# EAGLE design flexdrive_atlas_stack_draft_01 (EAGLE 6.2)
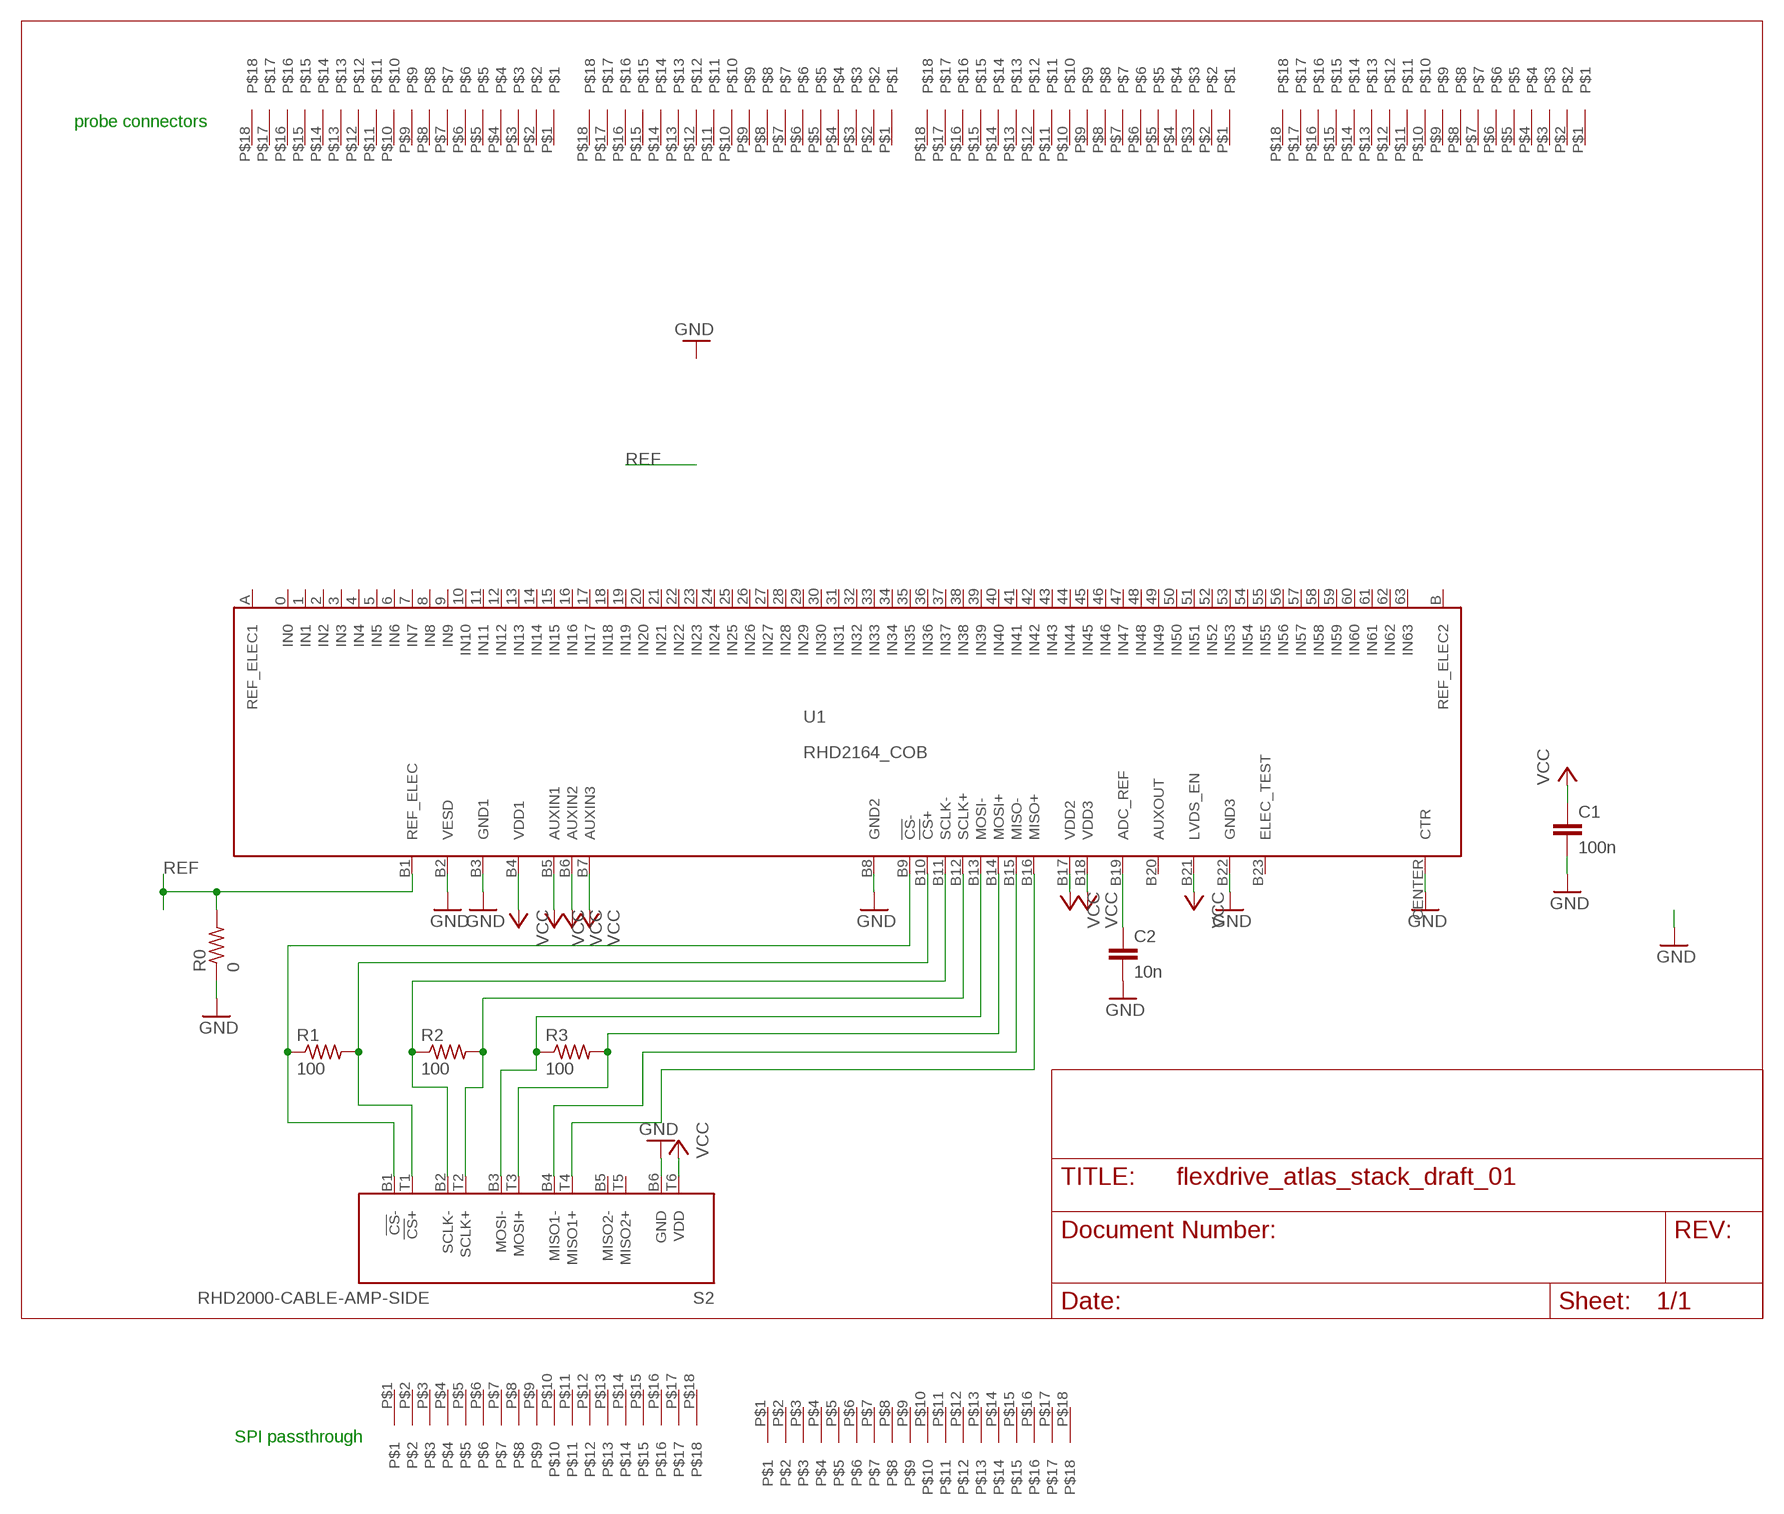
[diagram p0: schematic, sheet 1]

## Parts
C1  100n  C_0402  [0402]
C2  10n  C_0201  [0201]
R0  0  R_0402  [0402]
R1  100  R_0201  [0201]
R2  100  R_0201  [0201]
R3  100  R_0201  [0201]
S2  RHD2000-CABLE-AMP-SIDE  [OMNETICS_PZN-12-AA]
U1  RHD2164_COB  [RHD2164_COB]
U$1  18PIN_035MM_SLIMSTACK  [18PIN_025MM_SLIMSTACK]
U$2  18PIN_035MM_SLIMSTACK  [18PIN_025MM_SLIMSTACK]
U$3  18PIN_035MM_SLIMSTACK  [18PIN_025MM_SLIMSTACK]
U$4  18PIN_035MM_SLIMSTACK  [18PIN_025MM_SLIMSTACK]
U$5  18PIN_035MM_SLIMSTACK  [18PIN_025MM_SLIMSTACK]
U$6  18PIN_035MM_SLIMSTACK  [18PIN_025MM_SLIMSTACK]

## Nets
GND [thick]: C1.2 C2.2 R0.1 S2.B6(GND) U1.B2(VESD) U1.B3(GND1) U1.B8(GND2) U1.B22(GND3) U1.CENTER(CTR)
N$1: S2.T4(MISO1+) U1.B16(MISO+)
N$11: R1.1 S2.B1(!CS!-) U1.B9(!CS!-)
N$35: R1.2 S2.T1(!CS!+) U1.B10(!CS!+)
N$36: R2.1 S2.B2(SCLK-) U1.B11(SCLK-)
N$37: R2.2 S2.T2(SCLK+) U1.B12(SCLK+)
N$38: R3.1 S2.B3(MOSI-) U1.B13(MOSI-)
N$39: R3.2 S2.T3(MOSI+) U1.B14(MOSI+)
N$40: S2.B4(MISO1-) U1.B15(MISO-)
N$42 [thick]: C2.1 U1.B19(ADC_REF)
REF [thick]: R0.2 U1.B1(REF_ELEC)
VCC [thick]: C1.1 S2.T6(VDD) U1.B4(VDD1) U1.B5(AUXIN1) U1.B6(AUXIN2) U1.B7(AUXIN3) U1.B17(VDD2) U1.B18(VDD3) U1.B21(LVDS_EN)
Unconnected: S2.B5(MISO2-) S2.T5(MISO2+) U1.0(IN0) U1.1(IN1) U1.2(IN2) U1.3(IN3) U1.4(IN4) U1.5(IN5) U1.6(IN6) U1.7(IN7) U1.8(IN8) U1.9(IN9) U1.10(IN10) U1.11(IN11) U1.12(IN12) U1.13(IN13) U1.14(IN14) U1.15(IN15) U1.16(IN16) U1.17(IN17) U1.18(IN18) U1.19(IN19) U1.20(IN20) U1.21(IN21) U1.22(IN22) U1.23(IN23) U1.24(IN24) U1.25(IN25) U1.26(IN26) U1.27(IN27) U1.28(IN28) U1.29(IN29) U1.30(IN30) U1.31(IN31) U1.32(IN32) U1.33(IN33) U1.34(IN34) U1.35(IN35) U1.36(IN36) U1.37(IN37) U1.38(IN38) U1.39(IN39) U1.40(IN40) U1.41(IN41) U1.42(IN42) U1.43(IN43) U1.44(IN44) U1.45(IN45) U1.46(IN46) U1.47(IN47) U1.48(IN48) U1.49(IN49) U1.50(IN50) U1.51(IN51) U1.52(IN52) U1.53(IN53) U1.54(IN54) U1.55(IN55) U1.56(IN56) U1.57(IN57) U1.58(IN58) U1.59(IN59) U1.60(IN60) U1.61(IN61) U1.62(IN62) U1.63(IN63) U1.A(REF_ELEC1) U1.B20(AUXOUT) U1.B23(ELEC_TEST) U1.B(REF_ELEC2) U$1.P$1 U$1.P$2 U$1.P$3 U$1.P$4 U$1.P$5 U$1.P$6 U$1.P$7 U$1.P$8 U$1.P$9 U$1.P$10 U$1.P$11 U$1.P$12 U$1.P$13 U$1.P$14 U$1.P$15 U$1.P$16 U$1.P$17 U$1.P$18 U$2.P$1 U$2.P$2 U$2.P$3 U$2.P$4 U$2.P$5 U$2.P$6 U$2.P$7 U$2.P$8 U$2.P$9 U$2.P$10 U$2.P$11 U$2.P$12 U$2.P$13 U$2.P$14 U$2.P$15 U$2.P$16 U$2.P$17 U$2.P$18 U$3.P$1 U$3.P$2 U$3.P$3 U$3.P$4 U$3.P$5 U$3.P$6 U$3.P$7 U$3.P$8 U$3.P$9 U$3.P$10 U$3.P$11 U$3.P$12 U$3.P$13 U$3.P$14 U$3.P$15 U$3.P$16 U$3.P$17 U$3.P$18 U$4.P$1 U$4.P$2 U$4.P$3 U$4.P$4 U$4.P$5 U$4.P$6 U$4.P$7 U$4.P$8 U$4.P$9 U$4.P$10 U$4.P$11 U$4.P$12 U$4.P$13 U$4.P$14 U$4.P$15 U$4.P$16 U$4.P$17 U$4.P$18 U$5.P$1 U$5.P$2 U$5.P$3 U$5.P$4 U$5.P$5 U$5.P$6 U$5.P$7 U$5.P$8 U$5.P$9 U$5.P$10 U$5.P$11 U$5.P$12 U$5.P$13 U$5.P$14 U$5.P$15 U$5.P$16 U$5.P$17 U$5.P$18 U$6.P$1 U$6.P$2 U$6.P$3 U$6.P$4 U$6.P$5 U$6.P$6 U$6.P$7 U$6.P$8 U$6.P$9 U$6.P$10 U$6.P$11 U$6.P$12 U$6.P$13 U$6.P$14 U$6.P$15 U$6.P$16 U$6.P$17 U$6.P$18

## Notes on the sheet
- probe connectors
- SPI passthrough

## Library data of the parts
C1 C2 = RHD2000_eval_board:C: Capacitor
R0 R1-R3 = RHD2000_eval_board:R: Resistor
S2 = RHD2000:RHD2000-CABLE-AMP-SIDE
U1 = RHD2000:RHD2164
U$1-U$6 = RHD2000:18PIN_035MM_SLIMSTACK

## Net classes
1 thick: width 0.102 mm
2 power: width 0.61 mm

## Board
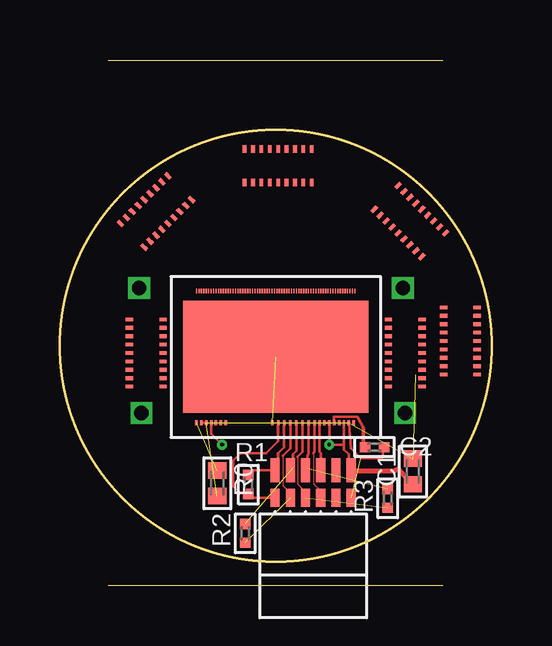
[diagram p1: board, top side]
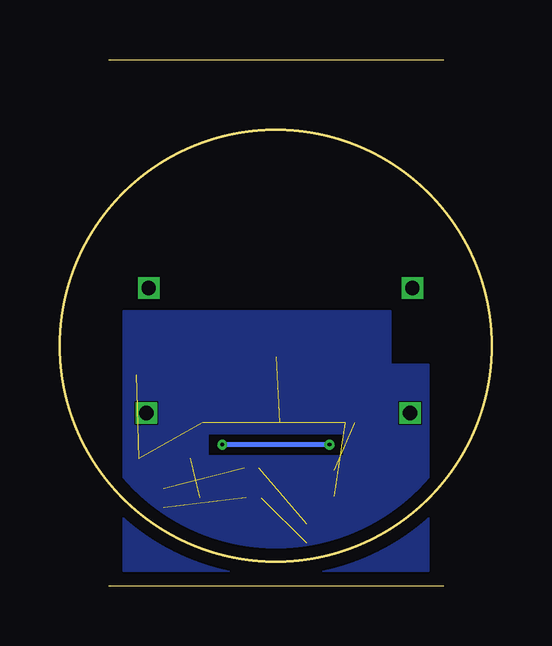
[diagram p2: board, bottom side, seen from below]

Size 18 x 21.91 mm. Coordinates in mm from the lower left corner, seen from the top.
Outline: 15.97,0 2,0
Outline: 2,21.91 15.97,21.91
Outline: circle at 9,10 radius 9
Copper layers (1*16): Top 0.035mm / dielectric 1.5mm / Bottom 0.035mm
Design rules: minimum track width 2mil, minimum drill 6mil, track to track 2mil, track to pad 2mil, pad to pad 2mil, via to via 2mil, smd to smd 2mil, copper to edge 20mil, drill to drill 15mil, minimum pad ring 5mil, minimum via ring 5mil, stop-mask expansion 2mil, vias tented up to drill 0mil, thermal gap 10mil
tRestrict: area 8.9,6.6 to 9,6.9; area 9.2,6.6 to 9.3,6.9; area 9.5,6.6 to 9.5,6.9; area 9.7,6.6 to 9.8,6.9; area 10,6.6 to 10,6.9; area 10.2,6.6 to 10.3,6.9

### Footprints (pad centres in the part's own frame; a part is rotated, then mirrored left to right if it is on the bottom)
0402 = smd 0.686 x 0.762: 1 -0.533,0; 2 0.533,0
0201 = smd 0.432 x 0.432: 1 -0.394,0; 2 0.394,0
OMNETICS_PZN-12-AA = smd 0.381 x 0.762: B1 1.587,-1.016; B2 0.953,-1.016; B3 0.318,-1.016; B4 -0.318,-1.016; B5 -0.953,-1.016; B6 -1.587,-1.016 | smd 0.381 x 1.016: T1 1.587,-2.159; T2 0.953,-2.159; T3 0.318,-2.159; T4 -0.318,-2.159; T5 -0.953,-2.159; T6 -1.587,-2.159
RHD2164_COB = smd 0.051 x 0.203: 0 -3.2,2.743; 1 -3.099,2.743; 2 -2.997,2.743; 3 -2.896,2.743; 4 -2.794,2.743; 5 -2.692,2.743; 6 -2.591,2.743; 7 -2.489,2.743; 8 -2.388,2.743; 9 -2.286,2.743; 10 -2.184,2.743; 11 -2.083,2.743; 12 -1.981,2.743; 13 -1.88,2.743; 14 -1.778,2.743; 15 -1.676,2.743; 16 -1.575,2.743; 17 -1.473,2.743; 18 -1.372,2.743; 19 -1.27,2.743; 20 -1.168,2.743; 21 -1.067,2.743; 22 -0.965,2.743; 23 -0.864,2.743; 24 -0.762,2.743; 25 -0.66,2.743; 26 -0.559,2.743; 27 -0.457,2.743; 28 -0.356,2.743; 29 -0.254,2.743; 30 -0.152,2.743; 31 -0.051,2.743; 32 0.051,2.743; 33 0.152,2.743; 34 0.254,2.743; 35 0.356,2.743; 36 0.457,2.743; 37 0.559,2.743; 38 0.66,2.743; 39 0.762,2.743; 40 0.864,2.743; 41 0.965,2.743; 42 1.067,2.743; 43 1.168,2.743; 44 1.27,2.743; 45 1.372,2.743; 46 1.473,2.743; 47 1.575,2.743; 48 1.676,2.743; 49 1.778,2.743; 50 1.88,2.743; 51 1.981,2.743; 52 2.083,2.743; 53 2.184,2.743; 54 2.286,2.743; 55 2.388,2.743; 56 2.489,2.743; 57 2.591,2.743; 58 2.692,2.743; 59 2.794,2.743; 60 2.896,2.743; 61 2.997,2.743; 62 3.099,2.743; 63 3.2,2.743; A -3.302,2.743; B 3.302,2.743 | smd 0.102 x 0.203: B1 -3.302,-2.743; B2 -3.099,-2.743; B3 -2.896,-2.743; B4 -2.692,-2.743; B5 -2.489,-2.743; B6 -2.286,-2.743; B7 -2.083,-2.743; B8 -0.152,-2.743; B9 0.102,-2.743; B10 0.356,-2.743; B11 0.61,-2.743; B12 0.864,-2.743; B13 1.118,-2.743; B14 1.372,-2.743; B15 1.626,-2.743; B16 1.829,-2.743; B17 2.032,-2.743; B18 2.235,-2.743; B19 2.438,-2.743; B20 2.642,-2.743; B21 2.845,-2.743; B22 3.048,-2.743; B23 3.251,-2.743 | smd 7.722 x 4.674: CENTER 0,0
18PIN_025MM_SLIMSTACK = smd 0.152 x 0.305: P$1 0,0; P$2 0.35,0; P$3 0.7,0; P$4 -0.35,0; P$5 1.05,0; P$6 -0.7,0; P$7 -1.05,0; P$8 -1.4,0; P$9 1.05,1.4; P$10 0.7,1.4; P$11 0.35,1.4; P$12 0,1.4; P$13 -0.35,1.4; P$14 -0.7,1.4; P$15 -1.05,1.4; P$16 -1.4,1.4; P$17 1.4,1.4; P$18 1.4,0

### Placement (x,y rotation side)
C1  14.72,4.76 90 top
C2  13.12,5.77 0 top
R0  6.56,4.27 90 top
R1  7.85,4.22 90 top
R2  7.73,2.18 90 top
R3  13.67,3.65 90 top
S2  10.56,2.65 180 top
U1  9,9.54 0 top
U$1  9.1,16.8 0 top
U$2  4.5,15.1 45 top
U$3  17.4,10.2 90 top
U$4  14.1,14.7 315 top
U$5  4.3,9.7 90 top
U$6  13.7,9.7 270 top

### Tracks (layer width: path | path; a pad name or v marks a point on that pad's centre or on a via)
GND  (7 unrouted)
  Top 0.102: U1.B2 U1.B3 | U1.B22 12.15,5.73 12.56,5.32 13.46,5.32 C2.2
  pour Bottom: 2.63,0.64 2.63,9.21 4.22,9.21 4.22,11.43 15.34,11.43 15.34,0.64 11.84,0.64 11.84,6.35 6.13,6.35 6.13,0.64
  pour Bottom: 6.13,0.64 6.13,5.4 11.84,5.4 11.84,0.64
N$1
  Top 0.102: U1.B16 10.83,5.58 10.88,5.52 S2.T4
N$3  (via drill 0.6)
  other vias: 14.4,7.2 3.4,7.2
N$4  (via drill 0.6)
  other vias: 14.3,12.4 3.3,12.4
N$11
  Top 0.102: S2.B1 8.01,3.67 R1.1 7.83,3.85 7.52,3.85 7.22,4.15 7.22,5.22 7.52,5.52 8.59,5.52 9.1,6.03 U1.B9
N$35
  Top 0.102: R1.2 8.06,4.81 S2.T1 9.1,4.94 9.1,5.52 9.35,5.78 U1.B10
N$36  (1 unrouted)
  Top 0.051: 9.3,5.42 9.3,4.18 9.61,3.87 S2.B2
  Top 0.102: U1.B11 9.61,5.73 9.3,5.42
N$37  (1 unrouted)
  Top 0.102: U1.B12 9.86,5.63 9.71,5.47 9.71,4.92 S2.T2
N$38  (1 unrouted)
  Top 0.051: 9.91,5.37 9.91,4.25 10.24,3.92 S2.B3 10.24,3.82
  Top 0.102: U1.B13 10.12,5.58 9.91,5.37
N$39  (1 unrouted)
  Top 0.102: U1.B14 10.37,5.47 10.32,5.42 10.32,4.89 S2.T3
N$40
  Top 0.051: 10.57,5.52 10.57,4.25 10.88,3.95 S2.B4 10.88,3.85
  Top 0.102: U1.B15 10.62,5.58 10.57,5.52
N$42
  Top 0.102: U1.B19 11.44,7.05 12.4,7.05 12.66,6.59 | 12.66,5.84 C2.1
  Top 0.152: 12.66,6.59 12.66,5.84
REF  (1 unrouted)
VCC  (via drill 0.15)
  Top 0.051: U1.B4 U1.B5 U1.B6 U1.B7
  Top 0.102: U1.B17 U1.B18 v11.23,5.88 11.84,5.88 | U1.B21 11.84,5.88 | 11.84,5.88 11.84,5.68 12.05,5.47 12.05,4.92 S2.T6 12.2,4.76 | U1.B4 6.3,6.34 v6.76,5.88
  Top 0.203: C1.1 14.12,4.85 13.93,4.76 12.2,4.76
  Bottom 0.203: v6.76,5.88 v11.23,5.88

### Text on the board
tDocu: stack | stack